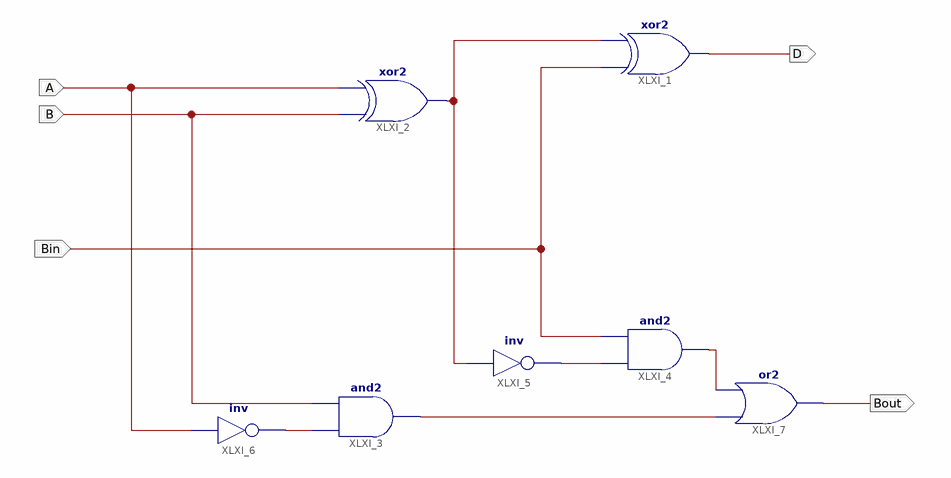
[diagram p0: schematic sheet 1]
// Xilinx ISE schematic Subtractor.sch (artix7) as structural Verilog: 7 symbols, 5 ports
module Subtractor (
  input  A,
  input  B,
  input  Bin,
  output D,
  output Bout
);

  wire XLXN_27, XLXN_42, XLXN_44, XLXN_45, XLXN_46;

  xor XLXI_1 (D, Bin, XLXN_42);
  xor XLXI_2 (XLXN_42, B, A);
  and XLXI_3 (XLXN_45, XLXN_27, B);
  and XLXI_4 (XLXN_46, XLXN_44, Bin);
  not XLXI_5 (XLXN_44, XLXN_42);
  not XLXI_6 (XLXN_27, A);
  or XLXI_7 (Bout, XLXN_45, XLXN_46);
endmodule
